# EAGLE design Pandora Driver-multi-page (EAGLE 5.11)
MFG: AVX; PN: TCJR106M006R0500

## Sheet 1 of 3
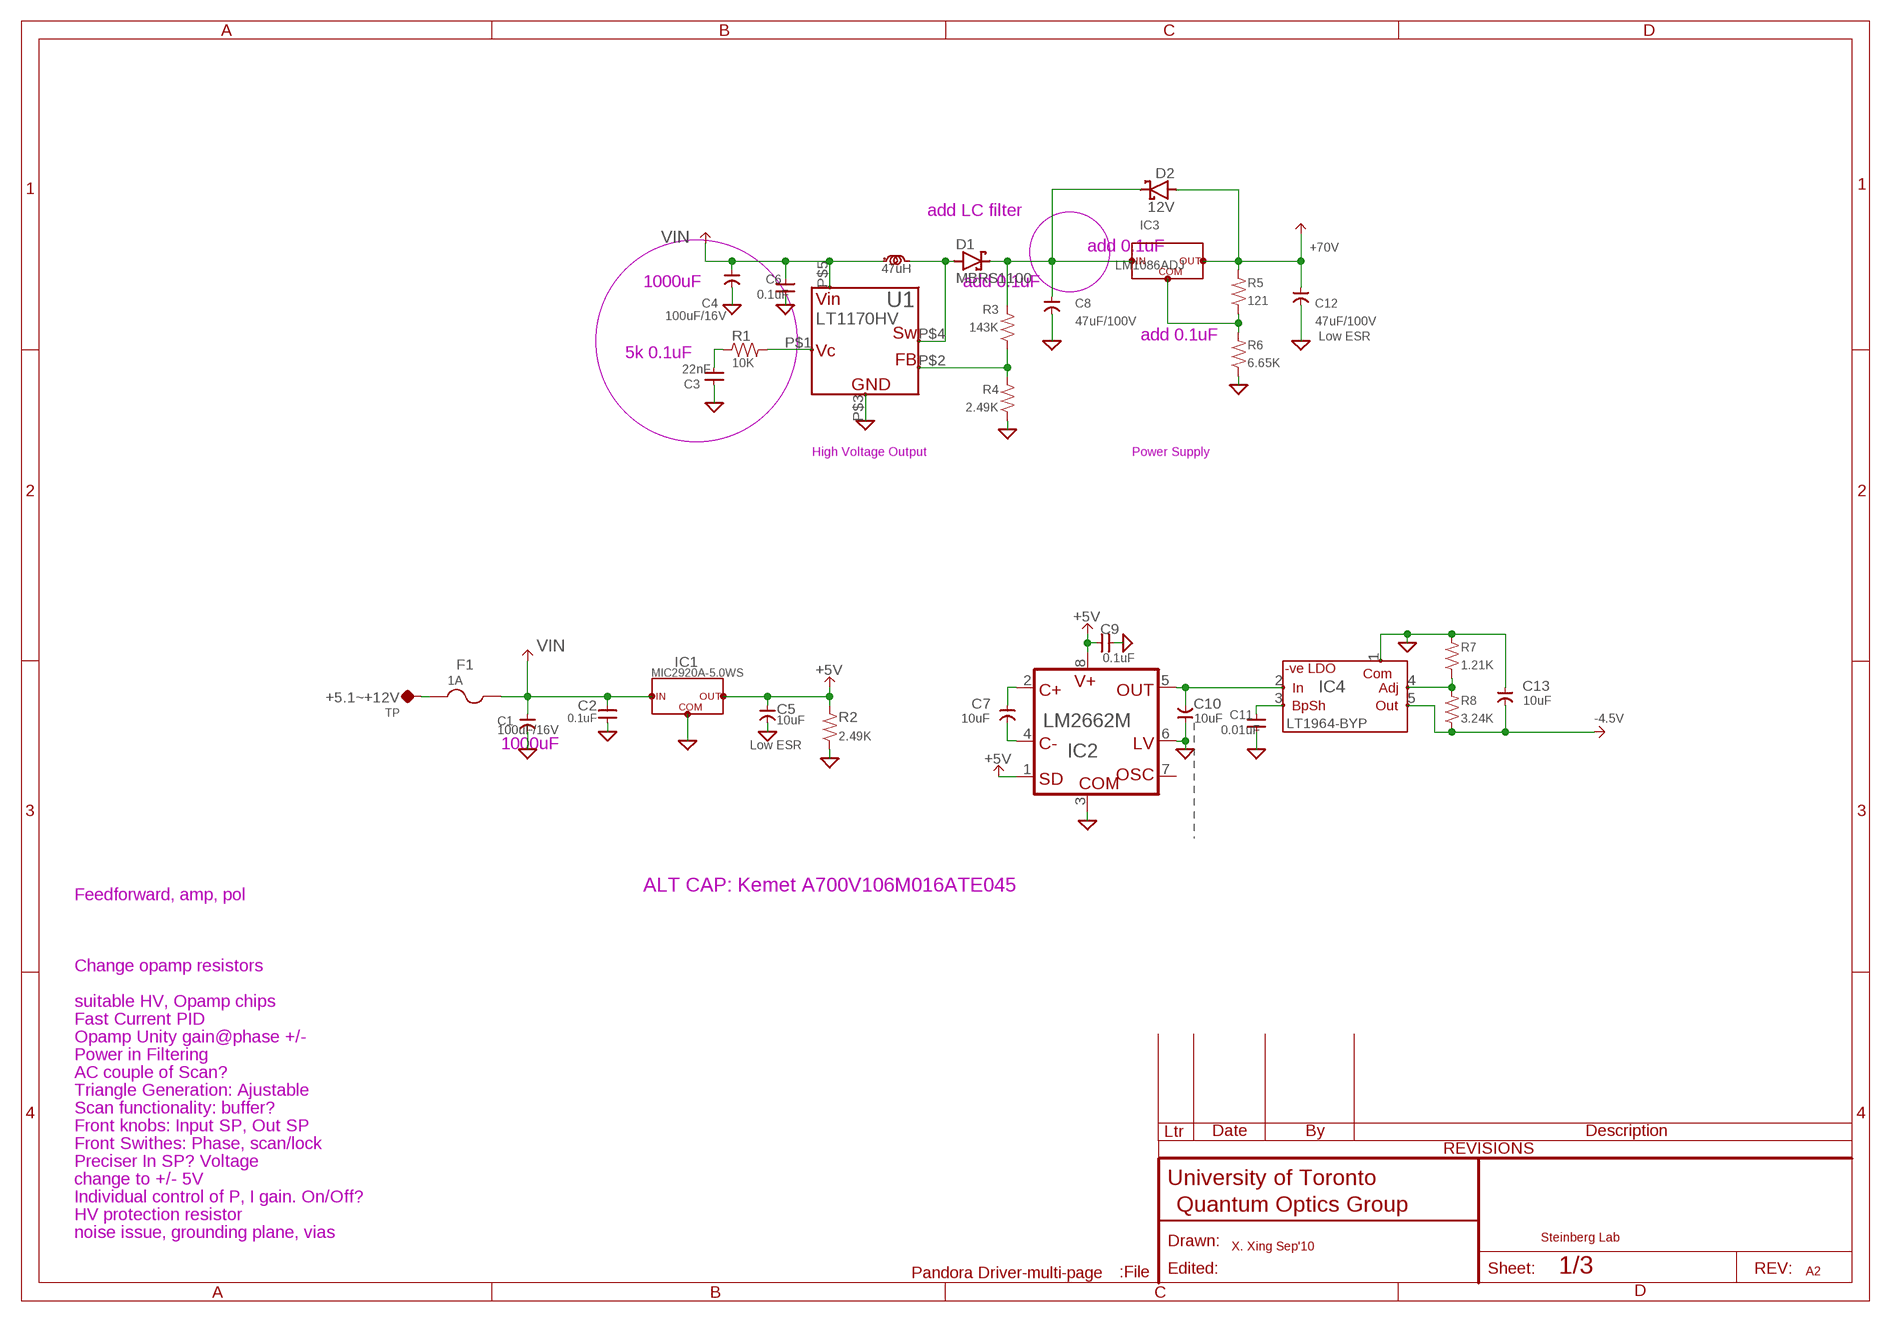
[diagram p0: schematic, sheet 1]

### Parts
+5.1~+12V  TP  TP-0.052"  [TP-0.052]
C1  100uF/16V  CAP-POL-PANA-D  [PANASONIC_D]
C2  0.1uF  CAP-V-0805  [2012(0805)]
C3  22nF  CAP-H-0805  [2012(0805)]
C4  100uF/16V  CAP-POL-PANA-D  [PANASONIC_D]
C5  10uF  CAP-POL--EIA7343  [7343]
C6  0.1uF  CAP-H-0805  [2012(0805)]
C7  10uF  CAP-POL--EIA7343  [7343]
C8  47uF/100V  CAP-POL-G13(X)  [PANASONIC_G13X]
C9  0.1uF  CAP-H-0805  [2012(0805)]
C10  10uF  CAP-POL--EIA7343  [7343]
C11  0.01uF  CAP-H-0805  [2012(0805)]
C12  47uF/100V  CAP-POL-G13(X)  [PANASONIC_G13X]
C13  10uF  CAP-POL--EIA7343  [7343]
D1  MBRS1100  MBRS130  [EIA-B(SMB)]
D2  12V  DIODE,SCHOTTKY-SOT-23  [SOT23]
F1  1A  FUSE-LITTLEFUSE_0154  [FUSE:LITTLEFUSE_0154]
IC1  MIC2920A-5.0WS  REGULATOR:3PIN-SOT223(TAB,2PINS)  [SOT223(C)]
IC2  LM2662M  LM2663M  [SOIC-8@1]
IC3  LM1086ADJ  REGULATOR:LM1086(LDO)-TO263  [TO263]
IC4  LT1964-BYP  REGULATOR:LT1964(NEG,200MA)-ES5-  [SOT23-5]
L1  47uH  INDUCTOR-PANASONIC_ELLATV  [PANASONIC_ELLATV(COIL)]
R1  10K  R-H-0805  [2012(0805)]
R2  2.49K  R-V-0805  [2012(0805)]
R3  143K  R-H-0805  [2012(0805)]
R4  2.49K  R-H-0805  [2012(0805)]
R5  121  R-H-0805  [2012(0805)]
R6  6.65K  R-H-0805  [2012(0805)]
R7  1.21K  R-H-0805  [2012(0805)]
R8  3.24K  R-H-0805  [2012(0805)]
U1  LT1170HV  [TO263-5]

### Nets
+5V [power]: C5.+VE(POS) C9.1 IC1.3(OUT) IC2.1(SD) IC2.8(V+) R2.2 ; also sheet 2,3
+70V [power]: C12.+(POS) D2.1(A) IC3.2(OUT) R5.2 ; also sheet 3
-4.5V [power]: C13.-VE(NEG) IC4.5(OUT) R8.1 ; also sheet 2,3
-5IN [power]: C10.-VE(NEG) IC2.5(OUT) IC4.2(IN)
GND: C1.-(NEG) C2.1 C3.2 C4.-(NEG) C5.-VE(NEG) C6.1 C8.-(NEG) C9.2 C10.+VE(POS) C11.1 C12.-(NEG) C13.+VE(POS) IC1.2(COM) IC2.3(COM) IC2.6(LV) IC4.1(COM) R2.1 R4.1 R6.1 R7.2 U1.P$3(GND) ; also sheet 2,3
N$010 [power]: +5.1~+12V.TP F1.1(1A)
N$13: R1.2 U1.P$1(VC)
N$17: C3.1 R1.1
N$19: R3.1 R4.2 U1.P$2(FB)
N$22 [power]: D1.A-(A) L1.2(B) U1.P$4(SW)
N$033 [power]: C8.+(POS) D1.K+(C) D2.3(C) IC3.3(VI) R3.2
N$034: IC3.1(COM) R5.1 R6.2
N$041: C7.+VE(POS) IC2.2(C+)
N$042: C7.-VE(NEG) IC2.4(C-)
N$057: C11.2 IC4.3(BP/SH)
N$060: IC4.4(ADJ) R7.1 R8.2
VIN [power]: C1.+(POS) C2.2 C4.+(POS) C6.2 F1.2(2A) IC1.1(VI) L1.1(A) U1.P$5(VIN)
Unconnected: IC2.7(OSC)

### Notes on the sheet
- add LC filter
- add 0.1uF
- 1000uF | add 0.1uF
- add 0.1uF | Low ESR
- 5k 0.1uF
- High Voltage Output | Power Supply
- 1000uF | Low ESR
- ALT CAP: Kemet A700V106M016ATE045
- Feedforward, amp, pol
- Change opamp resistors
- suitable HV, Opamp chips
- Fast Current PID
- Opamp Unity gain@phase +/-
- Power in Filtering
- AC couple of Scan?
- Triangle Generation: Ajustable
- Scan functionality: buffer?
- Front knobs: Input SP, Out SP
- Front Swithes: Phase, scan/lock
- Preciser In SP? Voltage
- change to +/- 5V
- Individual control of P, I gain. On/Off?
- HV protection resistor
- noise issue, grounding plane, vias
- Steinberg Lab
- X. Xing Sep'10
- A2

## Sheet 2 of 3
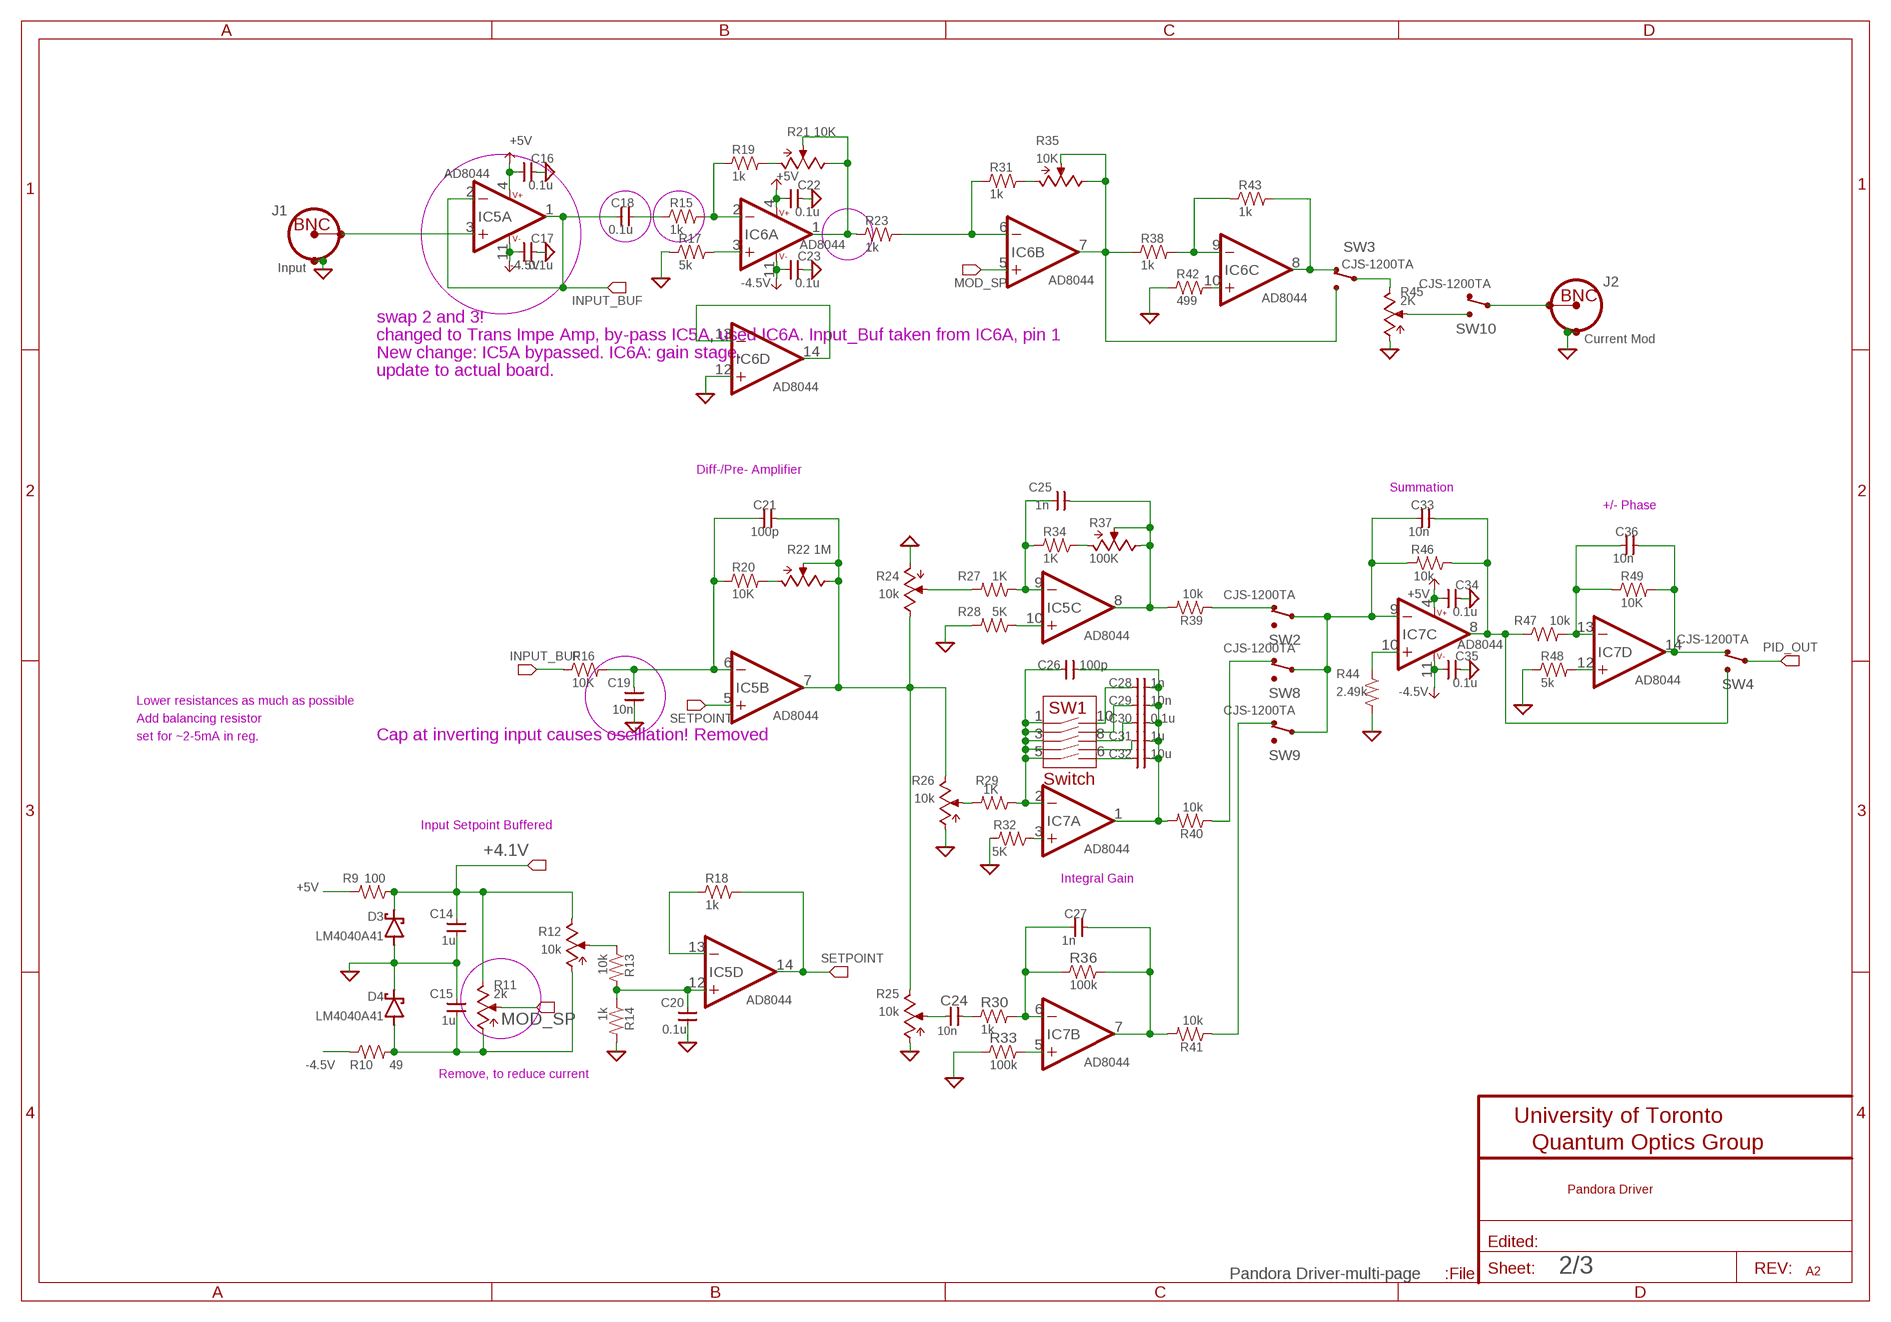
[diagram p1: schematic, sheet 2]

### Parts
C14  1u  CAP-H-0805  [2012(0805)]
C15  1u  CAP-H-0805  [2012(0805)]
C16  0.1u  CAP-H-0805  [2012(0805)]
C17  0.1u  CAP-H-0805  [2012(0805)]
C18  0.1u  CAP-H-0805  [2012(0805)]
C19  10n  CAP-H-0805  [2012(0805)]
C20  0.1u  CAP-H-0805  [2012(0805)]
C21  100p  CAP-H-0805  [2012(0805)]
C22  0.1u  CAP-H-0805  [2012(0805)]
C23  0.1u  CAP-H-0805  [2012(0805)]
C24  10n  CAP-H-0805  [2012(0805)]
C25  1n  CAP-H-0805  [2012(0805)]
C26  100p  CAP-H-0805  [2012(0805)]
C27  1n  CAP-H-0805  [2012(0805)]
C28  1n  CAP-H-0805  [2012(0805)]
C29  10n  CAP-H-0805  [2012(0805)]
C30  0.1u  CAP-H-0805  [2012(0805)]
C31  1u  CAP-H-0805  [2012(0805)]
C32  10u  CAP-H-0805  [2012(0805)]
C33  10n  CAP-H-0805  [2012(0805)]
C34  0.1u  CAP-H-0805  [2012(0805)]
C35  0.1u  CAP-H-0805  [2012(0805)]
C36  10n  CAP-H-0805  [2012(0805)]
D3  LM4040A41  DIODE,SCHOTTKY-SOT-23  [SOT23]
D4  LM4040A41  DIODE,SCHOTTKY-SOT-23  [SOT23]
IC5  AD8044  OPAMP:LT1491(RRIO+,QUAD)-SO14  [SOIC-14]
IC6  AD8044  OPAMP:LT1491(RRIO+,QUAD)-SO14  [SOIC-14]
IC7  AD8044  OPAMP:LT1491(RRIO+,QUAD)-SO14  [SOIC-14]
J1  Input  CONN-BNC-TYPE1VERT  [CONN-BNC-AMP-TYPE1VERT]
J2  Current Mod  CONN-BNC-TYPE1VERT  [CONN-BNC-AMP-TYPE1VERT]
R9  100  R-H-0805  [2012(0805)]
R10  49  R-H-0805  [2012(0805)]
R11  2k  POT-3214W_TRIM  [BOURNS_3214]
R12  10k  POT-3214W_TRIM  [BOURNS_3214]
R13  10k  R-H-0805  [2012(0805)]
R14  1k  R-H-0805  [2012(0805)]
R15  1k  R-H-0805  [2012(0805)]
R16  10K  R-H-0805  [2012(0805)]
R17  5k  R-H-0805  [2012(0805)]
R18  1k  R-H-0805  [2012(0805)]
R19  1k  R-H-0805  [2012(0805)]
R20  10K  R-H-0805  [2012(0805)]
R21  10K  POT-3214W_TRIM  [BOURNS_3214]
R22  1M  POT-3214W_TRIM  [BOURNS_3214]
R23  1k  R-H-0805  [2012(0805)]
R24  10k  POT-3214W_TRIM  [BOURNS_3214]
R25  10k  POT-3214W_TRIM  [BOURNS_3214]
R26  10k  POT-3214W_TRIM  [BOURNS_3214]
R27  1K  R-H-0805  [2012(0805)]
R28  5K  R-H-0805  [2012(0805)]
R29  1K  R-H-0805  [2012(0805)]
R30  1k  R-H-0805  [2012(0805)]
R31  1k  R-H-0805  [2012(0805)]
R32  5K  R-H-0805  [2012(0805)]
R33  100k  R-H-0805  [2012(0805)]
R34  1K  R-H-0805  [2012(0805)]
R35  10K  POT-3214W_TRIM  [BOURNS_3214]
R36  100k  R-H-0805  [2012(0805)]
R37  100K  POT-3214W_TRIM  [BOURNS_3214]
R38  1k  R-H-0805  [2012(0805)]
R39  10k  R-H-0805  [2012(0805)]
R40  10k  R-H-0805  [2012(0805)]
R41  10k  R-H-0805  [2012(0805)]
R42  499  R-H-0805  [2012(0805)]
R43  1k  R-H-0805  [2012(0805)]
R44  2.49k  R-H-0805  [2012(0805)]
R45  2K  POT-3214W_TRIM  [BOURNS_3214]
R46  10k  R-H-0805  [2012(0805)]
R47  10k  R-H-0805  [2012(0805)]
R48  5k  R-H-0805  [2012(0805)]
R49  10K  R-H-0805  [2012(0805)]
SW1  Switch  SWITCH:5PDT  [SWITCH:CTS219-5MST]
SW2  CJS-1200TA  SWITCH:SPDT_CJS-1200A1  [SWITCH:DIP(COPAL)]
SW3  CJS-1200TA  SWITCH:SPDT_CJS-1200A1  [SWITCH:DIP(COPAL)]
SW4  CJS-1200TA  SWITCH:SPDT_CJS-1200A1  [SWITCH:DIP(COPAL)]
SW8  CJS-1200TA  SWITCH:SPDT_CJS-1200A1  [SWITCH:DIP(COPAL)]
SW9  CJS-1200TA  SWITCH:SPDT_CJS-1200A1  [SWITCH:DIP(COPAL)]
SW10  CJS-1200TA  SWITCH:SPDT_CJS-1200A1  [SWITCH:DIP(COPAL)]

### Nets
+4.1V: C14.2 D3.3(C) R9.1 R11.CW R12.CW ; also sheet 3
+5V [power]: C16.1 C22.1 C34.1 IC5.4(V++) IC6.4(V++) IC7.4(V++) R9.2 ; also sheet 1,3
-4.5V [power]: C17.1 C23.1 C35.1 IC5.11(V-) IC6.11(V-) IC7.11(V-) R10.1 ; also sheet 1,3
CUR_MOD2: J2.CONDUCTOR SW10.COM
CUR_MOD_P3: IC6.7(B:OUT) R35.CW R35.W R38.1 SW3.1(NO\UP\RIGHT)
CUR_MOD_P4: IC6.8(C:OUT) R43.2 SW3.2(NC\DOWN\LEFT)
GND: C14.1 C15.2 C16.2 C17.2 C19.1 C20.1 C22.2 C23.2 C34.2 C35.2 D3.1(A) D4.3(C) IC6.12(D:+IN) J1.SHIELD1 J1.SHIELD2 J2.SHIELD1 J2.SHIELD2 R14.2 R17.1 R24.CCW R25.CCW R26.CCW R28.2 R32.2 R33.1 R42.1 R44.2 R45.CCW R48.1 ; also sheet 1,3
INPUT_BUF: C18.2 IC5.1(A:OUT) IC5.2(A:-IN) R16.1
MOD_SP: IC6.5(B:+IN) R11.W
N$004: C19.2 C21.1 IC5.6(B:-IN) R16.2 R20.1
N$006: C31.1 SW1.7(4B)
N$009: C21.2 IC5.7(B:OUT) R22.CW R22.W R24.CW R25.CW R26.CW
N$011: IC6.3(A:+IN) R17.2
N$012: R24.W R27.2
N$014: C25.1 IC5.9(C:-IN) R27.1 R34.2
N$015: C25.2 IC5.8(C:OUT) R37.CW R37.W R39.2
N$016: C29.1 SW1.9(2B)
N$018: C30.1 SW1.8(3B)
N$020: C32.1 SW1.6(5B)
N$021: C26.2 C28.2 C29.2 C30.2 C31.2 C32.2 IC7.1(A:OUT) R40.2
N$023: R26.W R29.2
N$024: C20.2 IC5.12(D:+IN) R13.2 R14.1
N$025: R12.W R13.1
N$026: C26.1 IC7.2(A:-IN) R29.1 SW1.1(1A) SW1.2(2A) SW1.3(3A) SW1.4(4A) SW1.5(5A)
N$027: C28.1 SW1.10(1B)
N$028: R45.W SW10.1(NO\UP\RIGHT)
N$029: C33.2 IC7.8(C:OUT) R46.1 R47.1 SW4.1(NO\UP\RIGHT)
N$030: IC7.5(B:+IN) R33.2
N$031: IC5.13(D:-IN) R18.1
N$032: IC5.10(C:+IN) R28.1
N$035: IC7.10(C:+IN) R44.1
N$037: IC7.12(D:+IN) R48.2
N$038: C36.2 IC7.14(D:OUT) R49.2 SW4.2(NC\DOWN\LEFT)
N$039: R20.2 R22.CCW
N$040: C24.1 R25.W
N$050: C27.1 IC7.6(B:-IN) R30.2 R36.1
N$051: C27.2 IC7.7(B:OUT) R36.2 R41.2
N$052: C24.2 R30.1
N$053: C36.1 IC7.13(D:-IN) R47.2 R49.1
N$054: IC6.10(C:+IN) R42.2
N$056: IC7.3(A:+IN) R32.1
N$061: C33.1 IC7.9(C:-IN) R46.2 SW2.COM SW8.COM SW9.COM
N$062: IC6.13(D:-IN) IC6.14(D:OUT)
N$065: IC5.3(A:+IN) J1.CONDUCTOR
N$085: R34.1 R37.CCW
N$093: C15.1 D4.1(A) R10.2 R11.CCW R12.CCW
N$097: C18.1 R15.1
N$098: IC6.2(A:-IN) R15.2 R19.1
N$099: IC6.1(A:OUT) R21.CW R21.W R23.1
N$100: IC6.6(B:-IN) R23.2 R31.1
N$101: IC6.9(C:-IN) R38.2 R43.1
N$102: R40.1 SW8.2(NC\DOWN\LEFT)
N$103: R41.1 SW9.2(NC\DOWN\LEFT)
N$104: R39.1 SW2.2(NC\DOWN\LEFT)
N$105: R19.2 R21.CCW
N$106: R31.2 R35.CCW
N$107: R45.CW SW3.COM
PID_OUT: SW4.COM ; also sheet 3
SETPOINT: IC5.5(B:+IN) IC5.14(D:OUT) R18.2 ; also sheet 3
Unconnected: SW2.1(NO\UP\RIGHT) SW8.1(NO\UP\RIGHT) SW9.1(NO\UP\RIGHT) SW10.2(NC\DOWN\LEFT)

### Notes on the sheet
- swap 2 and 3!
- changed to Trans Impe Amp, by-pass IC5A, used IC6A. Input_Buf taken from IC6A, pin 1
- New change: IC5A bypassed. IC6A: gain stage.
- update to actual board.
- Diff-/Pre- Amplifier
- Summation
- +/- Phase
- Lower resistances as much as possible
- Add balancing resistor
- set for ~2-5mA in reg. | Cap at inverting input causes oscillation! Removed
- Input Setpoint Buffered
- Integral Gain
- Remove, to reduce current
- Pandora Driver
- A2

## Sheet 3 of 3
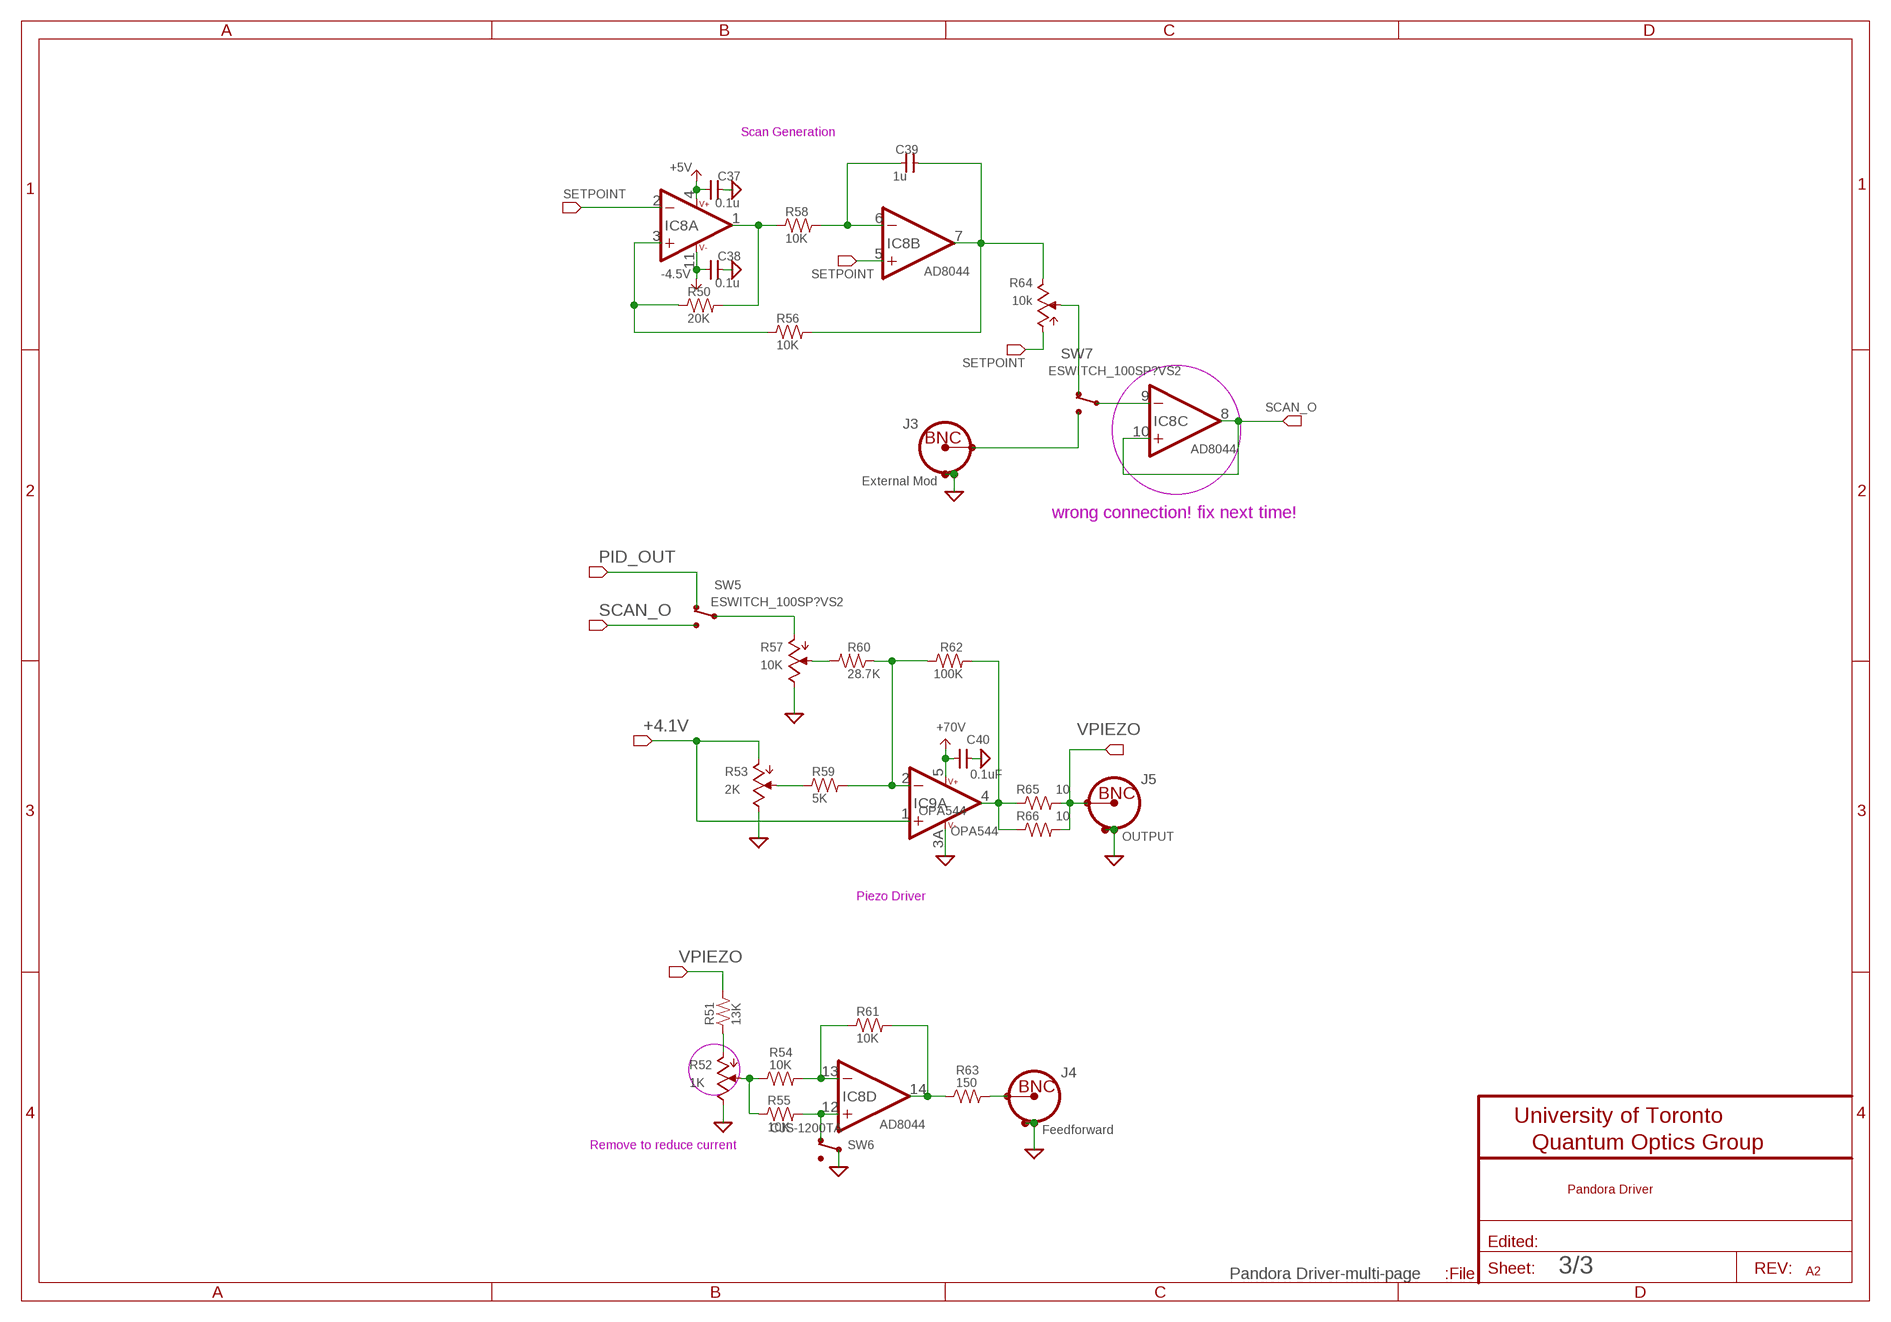
[diagram p2: schematic, sheet 3]

### Parts
C37  0.1u  CAP-H-0805  [2012(0805)]
C38  0.1u  CAP-H-0805  [2012(0805)]
C39  1u  CAP-H-0805  [2012(0805)]
C40  0.1uF  CAP-H-0805  [2012(0805)]
IC8  AD8044  OPAMP:LT1491(RRIO+,QUAD)-SO14  [SOIC-14]
IC9  OPA544  OPAMP:OPA544-TO263(KTT)  [TO263-5(KTT)]
J3  External Mod  CONN-BNC-TYPE1VERT  [CONN-BNC-AMP-TYPE1VERT]
J4  Feedforward  CONN-BNC-TYPE1VERT  [CONN-BNC-AMP-TYPE1VERT]
J5  OUTPUT  CONN-BNC-TYPE1VERT  [CONN-BNC-AMP-TYPE1VERT]
R50  20K  R-H-0805  [2012(0805)]
R51  13K  R-H-0805  [2012(0805)]
R52  1K  POT-3214W_TRIM  [BOURNS_3214]
R53  2K  POT-3590  [BOURNS_3590]
R54  10K  R-H-0805  [2012(0805)]
R55  10K  R-H-0805  [2012(0805)]
R56  10K  R-H-0805  [2012(0805)]
R57  10K  POT-3214W_TRIM  [BOURNS_3214]
R58  10K  R-H-0805  [2012(0805)]
R59  5K  R-H-0805  [2012(0805)]
R60  28.7K  R-H-0805  [2012(0805)]
R61  10K  R-H-0805  [2012(0805)]
R62  100K  R-H-0805  [2012(0805)]
R63  150  R-H-0805  [2012(0805)]
R64  10k  POT-3214W_TRIM  [BOURNS_3214]
R65  10  R-H-0805  [2012(0805)]
R66  10  R-H-0805  [2012(0805)]
SW5  ESWITCH_100SP?VS2  SWITCH:SPDT-ESWITCH_100SP?VS2  [SWITCH-ESWITCH_100SP?VS2]
SW6  CJS-1200TA  SWITCH:SPDT_CJS-1200A1  [SWITCH:DIP(COPAL)]
SW7  ESWITCH_100SP?VS2  SWITCH:SPDT-ESWITCH_100SP?VS2  [SWITCH-ESWITCH_100SP?VS2]

### Nets
+4.1V: IC9.1(A:+IN) R53.CCW ; also sheet 2
+5V [power]: C37.1 IC8.4(V++) ; also sheet 1,2
+70V [power]: C40.1 IC9.5(B:V++) ; also sheet 1
-4.5V [power]: C38.1 IC8.11(V-) ; also sheet 1,2
GND: C37.2 C38.2 C40.2 IC9.3A(B:V-) J3.SHIELD1 J3.SHIELD2 J4.SHIELD1 J4.SHIELD2 J5.SHIELD1 J5.SHIELD2 R52.CW R53.CW R57.CW SW6.COM ; also sheet 1,2
N$001: R51.1 R52.CCW
N$002: R52.W R54.1 R55.1
N$003: IC8.13(D:-IN) R54.2 R61.1
N$005: IC8.14(D:OUT) R61.2 R63.1
N$007: IC8.12(D:+IN) R55.2 SW6.2(NC\DOWN\LEFT)
N$008: J4.CONDUCTOR R63.2
N$036: IC8.3(A:+IN) R50.1 R56.1
N$043: C39.2 IC8.7(B:OUT) R56.2 R64.CW
N$044: IC8.1(A:OUT) R50.2 R58.1
N$045: C39.1 IC8.6(B:-IN) R58.2
N$046: IC9.2(A:-IN) R59.2 R60.1 R62.1
N$047: IC9.4(A:OUT) R62.2 R65.1 R66.1
N$048: R53.W R59.1
N$049: R57.W R60.2
N$055: R64.W SW7.NC(NC\DOWN\LEFT)
N$058: IC8.9(C:-IN) SW7.C(COM)
N$059: J3.CONDUCTOR SW7.NO(NO\UP\RIGHT)
PID_OUT: SW5.NC(NC\DOWN\LEFT) ; also sheet 2
PIEZO_CTRL1: R57.CCW SW5.C(COM)
SCAN_O: IC8.8(C:OUT) IC8.10(C:+IN) SW5.NO(NO\UP\RIGHT)
SETPOINT: IC8.2(A:-IN) IC8.5(B:+IN) R64.CCW ; also sheet 2
VPIEZO: J5.CONDUCTOR R51.2 R65.2 R66.2
Unconnected: SW6.1(NO\UP\RIGHT)

### Notes on the sheet
- Scan Generation
- wrong connection! fix next time!
- Piezo Driver
- Remove to reduce current
- Pandora Driver
- A2

## Library data of the parts
+5.1~+12V = QuantumOptics:TP: Testpoint, either SMT pad, small hole or loop style TP such as Keystone 5002K (0.042").
C1 C4 C8 C12 = QuantumOptics-x:CAP-POL-: Capacitor, Polarized, SMT 0805 and up, probably tantalum.
C2 = QuantumOptics:CAP-V-: Cap, SMT and Through-hole, 0402 and up.
C3 C6 C9 C11 C14-C40 = QuantumOptics:CAP-H-: Cap, SMT and Through-hole, 0402 and up.
C5 C7 C10 C13 = QuantumOptics:CAP-POL-: Capacitor, Polarized, SMT 0805 and up, probably tantalum.
D1 = QuantumOptics:MBRS130: MBRS130LT3, ON Semi et al, schottky, 1A 30V, SMB. General purpose schottky in SMT.
D2-D4 = QuantumOptics:DIODE,SCHOTTKY: Schottky Diode, general purpose.
F1 = QuantumOptics:FUSE: Fuse
IC1 = QuantumOptics-x:REGULATOR:3PIN: LM1086-xxx, National Semiconductor, LDO, adjustable or fixed. http://cache.national.com/ds/LM/LM1086.pdf
IC2 = QuantumOptics:LM2663: LM2663, switched cap DC-DC converter. Inverter, doubler, supply splitter.
IC3 = QuantumOptics:REGULATOR:LM1086(LDO): LM1086-xxx, National Semiconductor, LDO, adjustable or fixed. http://cache.national.com/ds/LM/LM1086.pdf
IC4 = QuantumOptics:REGULATOR:LT1964(NEG,200MA): LT1964, LinTech, negative LDO, 200mA, fixed or -5V, very low noise. Three versions: 1) adj with shutdown, 2) adj with reference bypass, 3) fixed 5V with bypass and shutdown. http://www.linear.com/pc/downloadDocument.do?navId=H0,C1,C1003,C1040,C1019,P2168,D1258
IC5-IC8 = QuantumOptics:OPAMP:LT1491(RRIO+,QUAD): LT1491, Linear Technology quad op-amp. Low power, RRIO plus "over the top" inputs, high gain, low Vio, low Ib, low GBW too.
IC9 = QuantumOptics:OPAMP:OPA544: Op Amp, generic, pick the right package. e.g. AD8605: SOT-23-5, RRIO, 10MHz, Ib = 1pA, Vio < 65uV, 2.7-5.5V.
J1-J5 = QuantumOptics:CONN-BNC: BNC PCB, horizontal or vertical, e.g. Horiz: Amp (5)227677-1, nut 1-329631-2, shoulder washer 330620, vert isolated 5227222-6, http://catalog.tycoelectronics.com/TE/bin/TE.Connect?C=1&M=BYPN&TCPN=5227222-6&RQPN=5227222-6 http://catalog.tycoelectronics.com/TE/bin/TE.Connect?C=1&PN=227677-1&M=STARTSWITH&LG=1&I=13&button.x=0&button.y=0 http://catalog.tycoelectronics.com/TE/bin/TE.Connect?C=1&M=BYPN&PID=4946&PN=227673-1&I=13; DESC: Input?
L1 = QuantumOptics-x:INDUCTOR: Inductor, generic inductor.
R1 R3-R10 R13-R20 R23 R27-R34 R36 R38-R44 R46-R51 R54-R56 R58-R63 R65 R66 = QuantumOptics:R-H-*: Resistor, SMT & Through-Hole, horizontal symbol
R2 = QuantumOptics:R-V-*: Resistor, SMT & Through-Hole, vertical symbol
R11 R12 R21 R22 R24-R26 R35 R37 R45 R53 = QuantumOptics:POT: Pot, regular or trimpot
R52 R57 R64 = QuantumOptics-x:POT: Pot, regular or trimpot
SW1 = QuantumOptics-x:SWITCH:5PDT: 5 position DIP switch, through-hole.
SW2-SW10 = QuantumOptics:SWITCH:SPDT: Switch, SPDT
U1 = QuantumOptics:LT1170HV

## Net classes
0 default: width 0.178 mm, drill 0.508 mm, clearance 0.178 mm
1 power: width 0.508 mm, drill 0.711 mm

## Board
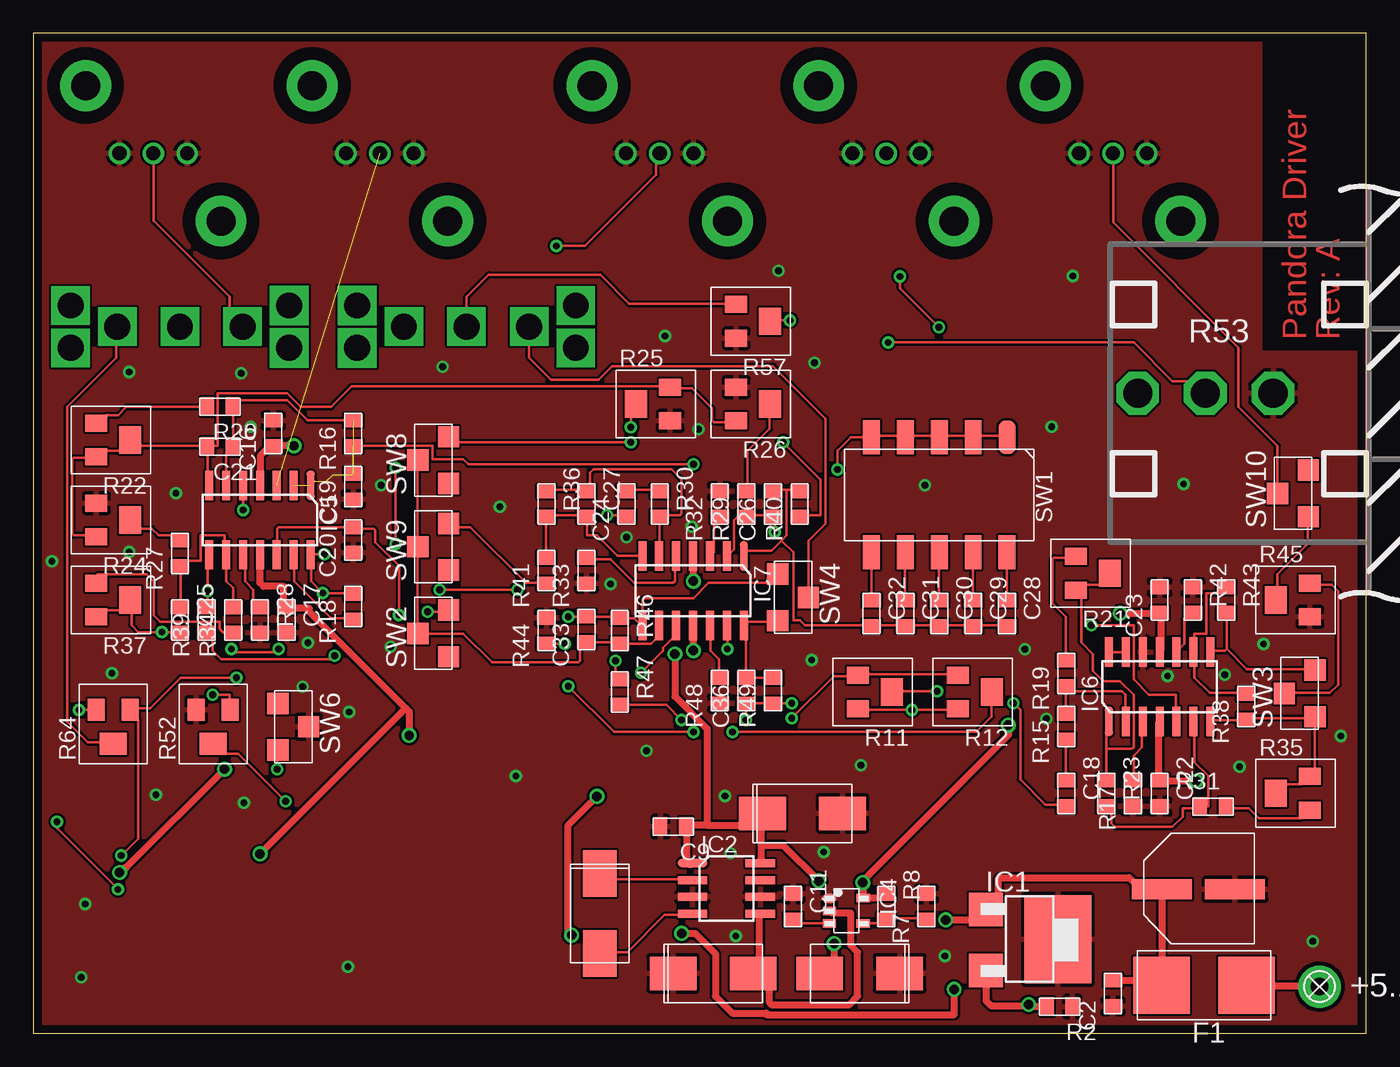
[diagram p3: board, top side]
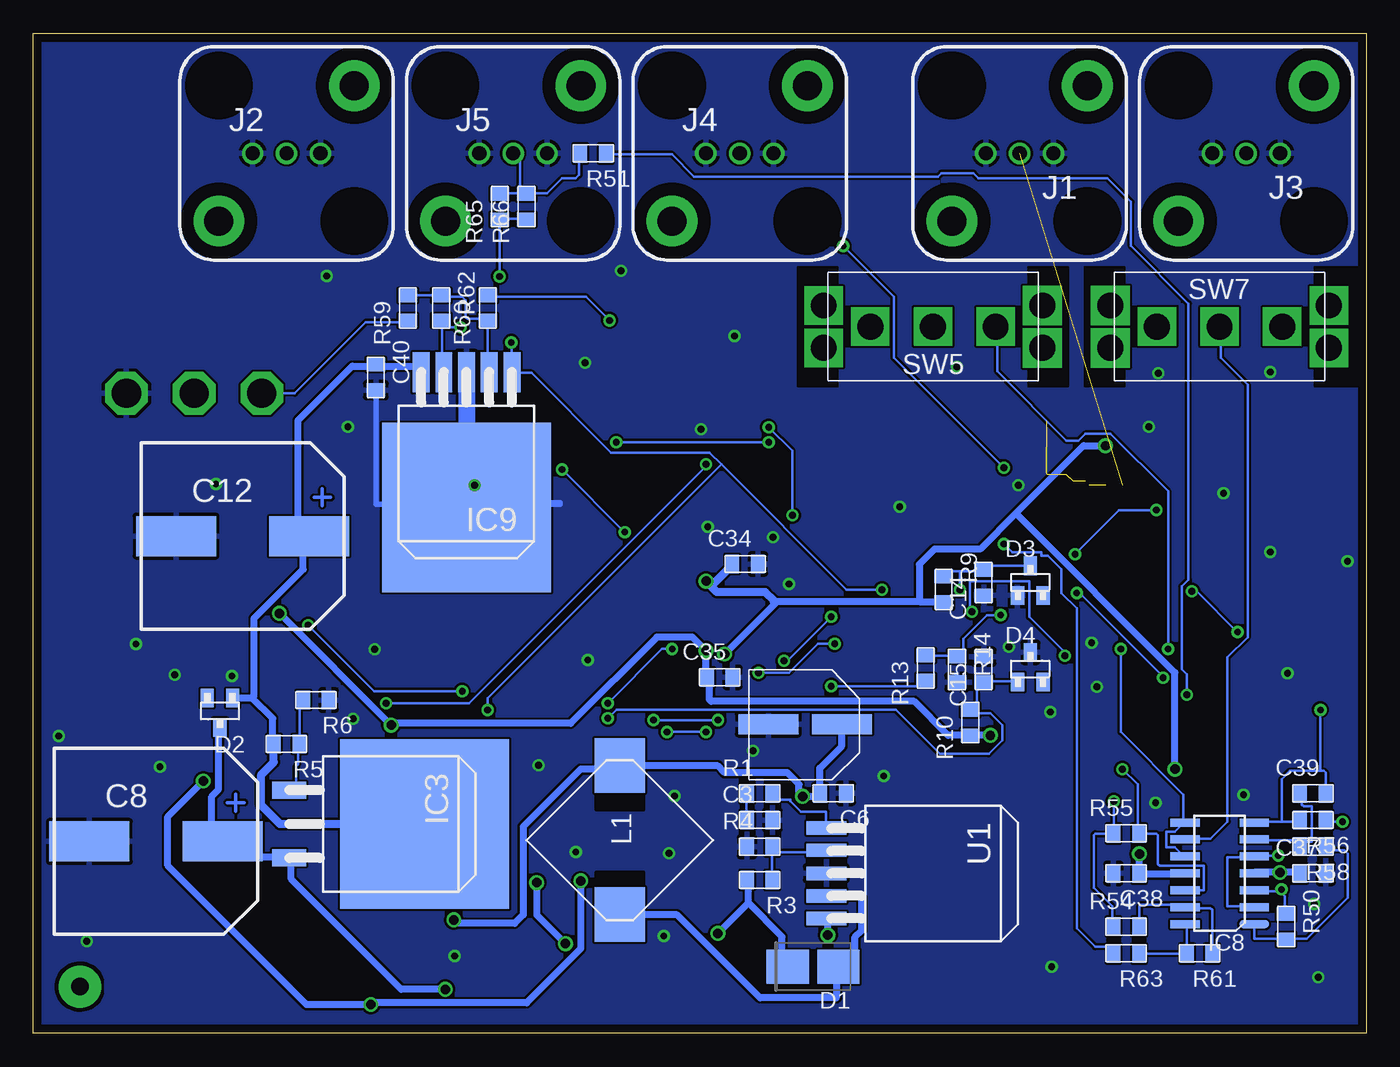
[diagram p4: board, bottom side, seen from below]

Size 100 x 75 mm. Coordinates in mm from the lower left corner, seen from the top.
Outline: 0,0 100,0 100,75 0,75 0,0
Copper layers (1+16): Top 0.035mm / dielectric 1.5mm / Bottom 0.035mm
Design rules "DRC standard check": minimum track width 7mil, minimum drill 20mil, track to track 7mil, track to pad 7mil, pad to pad 7mil, via to via 7mil, smd to smd 0mil, copper to edge 25mil, drill to drill 8mil, minimum pad ring 10mil, minimum via ring 8mil, stop-mask expansion 4mil, vias tented up to drill 0mil, thermal gap 10mil
bKeepout: area 25,6 to 34,18

### Footprints (pad centres in the part's own frame; a part is rotated, then mirrored left to right if it is on the bottom)
TP-0.052 = drill 1.321 pad 3.175 round: TP 0,0
PANASONIC_D = smd 4.5 x 1.5: + 2.75,0; - -2.75,0
2012(0805) = smd 1.016 x 1.397: 1 -0.953,0; 2 0.953,0
7343 = smd 3.5 x 2.5: +VE -3,0; -VE 3,0
PANASONIC_G13X = smd 3 x 6: + 0,-5; - 0,5
EIA-B(SMB) = smd 3.175 x 2.54: A- -1.905,0; K+ 1.905,0
SOT23 = smd 1 x 1.4: 1 -0.953,-0.953; 2 0.953,-0.953; 3 0,1.27
FUSE:LITTLEFUSE_0154 = smd 4.25 x 4.25: 1 -3.185,0; 2 3.185,0
SOT223(C) = smd 2.54 x 2.54: 1 -2.286,-2.54; 3 2.286,-2.54 | smd 6.6 x 5: 2 -0.05,2.87
SOIC-8@1 = smd 0.6 x 2.2: 1 -1.27,-2.54; 2 0,-2.54; 3 1.27,-2.54; 4 2.54,-2.54; 5 2.54,2.54; 6 1.27,2.54; 7 0,2.54; 8 -1.27,2.54
TO263 = smd 1.27 x 2.54: 1 -2.54,0; 3 2.54,0 | smd 12.7 x 12.7: 2 0,10.16
SOT23-5 = smd 0.635 x 0.991: 1 -0.635,-1.27; 2 0.318,-1.27; 3 1.27,-1.27; 4 1.27,1.27; 5 -0.635,1.27
SOIC-14 = smd 0.6 x 2.2: 1 -3.81,-2.6; 2 -2.54,-2.6; 3 -1.27,-2.6; 4 0,-2.6; 5 1.27,-2.6; 6 2.54,-2.6; 7 3.81,-2.6; 8 3.81,2.6; 9 2.54,2.6; 10 1.27,2.6; 11 0,2.6; 12 -1.27,2.6; 13 -2.54,2.6; 14 -3.81,2.6
TO263-5(KTT) = smd 1.27 x 3: 1 -3.404,0; 2 -1.702,0; 3A 0,0; 4 1.702,0; 5 3.404,0 | smd 12.7 x 12.7: 3B 0,10.16
CONN-BNC-AMP-TYPE1VERT = drill 1.067 round: CONDUCTOR 0,0; SHIELD1 -2.54,0; SHIELD2 2.54,0 | drill 2.184 pad 3.81 round: MTG1 -5.08,-5.08; MTG2 5.08,5.08
PANASONIC_ELLATV(COIL) = smd 4.064 x 3.81: 1 -5.588,0; 2 5.588,0
BOURNS_3214 = smd 1.651 x 1.27: CCW 1.27,-1.27; CW 1.27,1.27 | smd 1.651 x 2.032: W -1.27,0
BOURNS_3590 = drill 2.184 octagon: CCW -12.065,0; CW -6.985,0; W -17.145,0
SWITCH:CTS219-5MST = smd 1.27 x 2.54: 1 -5.08,-4.318; 2 -2.54,-4.318; 3 0,-4.318; 4 2.54,-4.318; 5 5.08,-4.318; 6 5.08,4.318; 7 2.54,4.318; 8 0,4.318; 9 -2.54,4.318; 10 -5.08,4.318
SWITCH:DIP(COPAL) = smd 1.6 x 1.6: 1 -1.75,-1.15; 2 1.75,-1.15; COM 0,1.15
SWITCH-ESWITCH_100SP?VS2 = drill 1.93 square: C 0,0; MTG3 8.2,1.59; MTG4 8.2,-1.59; NC 4.7,0; NO -4.7,0 | drill 1.93 pad 2.946 square: MTG1 -8.2,-1.59; MTG2 -8.2,1.59
TO263-5 = smd 1 x 3: P$1 -3.404,-8.001; P$2 -1.727,-8.001; P$3 0,-8.001; P$4 1.702,-8.001; P$5 3.378,-7.976

### Placement (x,y rotation side)
+5.1~+12V  96.5,3.5 0 top
C1  87.4,10.8 180 top
C2  81,3 90 top
C3  45.5,16 0 bottom
C4  42.1,23.2 0 bottom
C5  57.7,16.5 0 top
C6  40,18 180 bottom
C7  42.5,9 270 top
C8  90.8,14.4 90 bottom
C9  48,15.5 180 top
C10  51,4.5 0 top
C11  57,9.5 270 top
C12  84.3,37.3 90 bottom
C13  62,4.5 180 top
C14  28.7,33.8 90 bottom
C15  28.7,27.3 90 bottom
C16  18,45 90 top
C17  19,31 270 top
C18  77.5,18 270 top
C19  24,41 90 top
C20  24,37 90 top
C21  14,44 180 top
C22  84.5,18 270 top
C23  84.5,32.5 90 top
C24  44.5,39.7 90 top
C25  11,31 270 top
C26  55.5,39.7 90 top
C27  41.5,39.7 270 top
C28  73.05,31.5 270 top
C29  70.51,31.5 270 top
C30  67.97,31.5 270 top
C31  65.43,31.5 270 top
C32  62.89,31.5 270 top
C33  41.5,30.3 90 top
C34  46.6,35.2 0 bottom
C35  48.5,26.7 0 bottom
C36  53.5,25.7 90 top
C37  4,12 0 bottom
C38  18,12 180 bottom
C39  4,18 0 bottom
C40  74.3,49.2 270 bottom
D1  41.5,5 180 bottom
D2  86,24.2 180 bottom
D3  25.2,33.8 0 bottom
D4  25.2,27.3 0 bottom
F1  87.83,3.61 180 top
IC1  74,7 270 top
IC2  52,11.5 270 top
IC3  80.8,15.7 270 bottom
IC4  61,9.5 270 top
IC5  17,38.5 180 top
IC6  84.5,26 0 top
IC7  49.5,33.2 180 top
IC8  11,12 90 bottom
IC9  67.5,49.6 180 bottom
J1  26,66 180 bottom
J2  81,66 0 bottom
J3  9,66 180 bottom
J4  47,66 0 bottom
J5  64,66 0 bottom
L1  56,14.5 270 bottom
R1  45.5,18 0 bottom
R2  77,2 180 top
R3  45.5,11.5 180 bottom
R4  45.5,14 0 bottom
R5  81,21.7 180 bottom
R6  78.8,25 180 bottom
R7  67,9.5 90 top
R8  64,9.5 270 top
R9  31.7,33.3 270 bottom
R10  29.7,23.3 90 bottom
R11  63.15,25.6 180 top
R12  70.65,25.6 180 top
R13  33.05,27.4 90 bottom
R14  30.7,27.3 270 bottom
R15  77.5,23 90 top
R16  24,45 90 top
R17  82.5,18 90 top
R18  24,32 90 top
R19  77.5,27 90 top
R20  14,47 180 top
R21  79.5,34.5 180 top
R22  6,44.5 180 top
R23  80.5,18 270 top
R24  6,38.5 180 top
R25  46.5,47.2 0 top
R26  54,47.2 180 top
R27  11,36 90 top
R28  17,31 270 top
R29  53.5,39.7 90 top
R30  47,39.7 270 top
R31  88.5,17 0 top
R32  51.5,39.7 90 top
R33  41.5,34.7 90 top
R34  15,31 90 top
R35  94.5,18 0 top
R36  38.5,39.7 270 top
R37  6,32.5 180 top
R38  91,24.5 90 top
R39  13,31 90 top
R40  57.5,39.7 90 top
R41  38.5,34.7 90 top
R42  87,32.5 270 top
R43  89.5,32.5 270 top
R44  38.5,30.2 90 top
R45  94.5,32.5 0 top
R46  44,30.2 270 top
R47  44,25.6 270 top
R48  51.5,25.7 90 top
R49  55.5,25.7 90 top
R50  6,8 270 bottom
R51  58,66 180 bottom
R52  13.5,23 90 top
R53  100,48 0 top
R54  18,8 0 bottom
R55  18,15 0 bottom
R56  4,16 180 bottom
R57  54,53.4 180 top
R58  4,14 180 bottom
R59  71.9,54.4 90 bottom
R60  65.9,54.4 90 bottom
R61  12.5,6 180 bottom
R62  69.4,54.4 270 bottom
R63  18,6 180 bottom
R64  6,23 90 top
R65  65,62 90 bottom
R66  63,62 90 bottom
SW1  67.97,40.39 180 top
SW2  30,30 90 top
SW3  95,25.5 90 top
SW4  57,32.7 270 top
SW5  32.5,53 180 bottom
SW6  19.5,23 270 top
SW7  11,53 0 bottom
SW8  30,43 90 top
SW9  30,36.5 90 top
SW10  94.5,40.5 90 top
U1  32.5,12 270 bottom

### Tracks (layer width: path | path; a pad name or v marks a point on that pad's centre or on a via)
+4.1V  (via drill 0.51)
  Top 0.178: R11.CW 61.98,24.26 v65.91,24.26 69.34,24.26 R12.CW | v64.14,51.82 82.55,51.82 85.47,48.9 87,48.9 87.88,48.01 R53.CCW | v30.48,33.27 v36.32,33.27
  Bottom 0.178: 30.48,34.67 31.24,34.67 31.62,34.29 R9.1 | 30.48,34.67 28.7,34.67 C14.2 28.57,34.8 28.32,35.05 25.27,35.05 D3.3 | v64.14,51.82 64.14,49.66 IC9.1 64.01,49.53 62.61,49.53 56.64,43.56 49.28,43.56 48.39,42.67 | 30.48,34.67 v30.48,33.27 | v36.32,33.27 38.99,33.27 48.39,42.67 | v65.91,24.26 65.91,25.15 48.39,42.67
+5V  (via drill 0.71)
  Top 0.508: IC6.4 84.45,23.37 84.45,19.05 C22.1 84.71,18.92 v87.25,18.92 | 74.68,2.03 71.88,2.03 71.5,2.41 71.5,4.7 IC1.3 | 74.68,2.03 75.95,2.03 R2.2 | v74.68,2.16 74.68,2.03 | IC2.1 49.4,12.7 49.15,12.7 49.02,12.83 49.02,15.49 C9.1 49.15,15.62 50.55,15.62 | 54.61,14.1 54.61,16.38 C5.+VE 54.48,15.62 50.55,15.62 | 54.61,14.1 54.61,12.83 IC2.8 | IC5.4 17.02,41.15 17.03,41.16 17.03,43.31 17.65,43.94 17.91,43.94 C16.1 18.16,44.07 v19.56,44.07 | v49.53,33.91 49.53,35.69 IC7.4 | v6.48,12.06 6.86,12.45 6.99,12.45 v14.35,19.81 | v48.13,28.45 48.13,25.27 50.55,22.86 50.55,15.62 | v58.93,11.43 56.26,14.1 54.61,14.1
  Bottom 0.508: v87.25,18.92 89.92,16.26 89.92,12.57 79.5,2.16 v74.68,2.16 74.55,2.29 62.99,2.29 58.93,6.35 v58.93,11.43 | C37.1 4.95,12.06 v6.48,12.06 8.38,12.06 IC8.4 | 44.32,32.38 44.45,32.38 | 33.53,32.38 44.32,32.38 | 33.53,32.38 31.75,32.38 R9.2 | v19.56,44.07 21.21,44.07 26.29,38.99 | 26.29,38.99 28.96,36.32 32.38,36.32 33.53,35.18 33.53,32.38 | v14.35,19.81 14.35,27.05 26.29,38.99 | v48.13,28.45 44.32,32.26 44.32,32.38
  Bottom 0.61: 44.45,32.38 44.45,32.45 45.1,33.1 48.72,33.1 49.16,33.54 | 49.16,33.54 v49.53,33.91 | C34.1 47.55,35.15 49.16,33.54
+70V
  Bottom 0.508: IC9.5 70.87,49.66 71.25,50.04 74.3,50.04 C40.1 74.55,50.04 76.07,50.04 80.14,45.97 80.14,38.23 79.38,37.47 C12.+ 79.38,37.21 79.76,36.83 79.76,34.8 83.44,31.11 83.44,25.27 83.57,25.15 | 83.57,25.15 82.04,23.62 82.04,21.72 R5.2 | 83.57,25.15 84.96,25.15 D2.1
  Bottom 0.61: R5.2 81.95,20.35 82.9,19.4 82.9,17.1 81.5,15.7 IC3.2
-4.5V  (via drill 0.71)
  Top 0.508: IC6.11 84.58,28.7 84.58,31.5 C23.1 84.33,31.5 v81.53,31.5 | R8.1 63.88,10.54 63.5,10.16 62.36,10.16 IC4.5 62.23,10.29 v62.23,11.3 62.23,11.43 73.15,22.35 v73.15,23.11 | v60.07,6.73 60.07,5.46 59.05,4.45 C13.-VE | v49.53,28.7 49.53,30.48 IC7.11 | v28.19,22.35 28.19,24.13 27.94,24.38 | 27.94,24.38 20.7,31.62 20.7,31.88 19.05,31.88 C17.1 18.8,32 18.8,33.53 17.27,33.53 17.02,33.78 17.02,35.81 IC5.11 | v17.02,13.46 27.94,24.38
  Bottom 0.508: v62.23,11.3 62.23,8.89 v60.07,6.73 | v81.53,31.5 v73.15,23.11 73.03,23.24 59.69,23.24 53.21,29.72 50.55,29.72 v49.53,28.7 49.53,26.8 C35.1 49.28,26.54 49.28,25.02 49.15,24.89 33.91,24.89 31.37,22.35 29.84,22.35 R10.1 29.59,22.35 v28.19,22.35 | IC8.11 13.72,11.94 17.02,11.94 C38.1 17.02,12.19 v17.02,13.46
-5IN
  Top 0.508: IC4.2 59.82,9.14 59.94,9.02 61.34,9.02 61.34,6.6 61.85,6.1 61.85,2.79 61.21,2.16 55.37,2.16 55.24,2.29 55.24,3.56 54.36,4.45 54.1,4.45 C10.-VE 54.48,4.57 54.48,8.89 IC2.5
CUR_MOD2
  Top 0.178: SW10.COM 93.34,40.51 93.34,44.07 90.42,46.99 90.42,51.44 81.03,60.83 81.03,65.91 J2.CONDUCTOR
CUR_MOD_P3
  Top 0.178: IC6.7 88.39,23.5 90.93,23.5 R38.1 91.06,23.62 96.14,23.62 | 96.14,23.62 96.14,19.56 95.89,19.3 R35.CW 95.76,19.3 95.12,18.67 93.98,18.67 93.34,18.03 R35.W | 96.14,23.62 96.14,23.75 SW3.1 96.14,23.62
CUR_MOD_P4
  Top 0.178: 89.53,28.83 89.53,31.5 R43.2 | 89.53,28.83 89.41,28.7 88.39,28.7 IC6.8 | 89.53,28.83 91.06,27.3 96.14,27.3 SW3.2
GND  (via drill 0.51)
  Bottom 0.406: C40.2 74.3,39.7 67.5,39.7 | 67.5,39.7 60.5,39.7 60.5,39.8 67.5,39.8 67.5,39.7 | 67.5,39.7 IC9.3A
  other vias: 3.9,9.7 3.6,4.2 9.2,17.9 5.9,27 20.6,29.3 26.8,29 23.7,24.1 20.2,26 15.8,17.3 16.3,45.5 26.1,41.1 43.3,33.7 44.5,37.2 49.9,45.3 58.6,50.3 76.4,45.5 47.4,52.3 7.2,49.6 15.6,49.5 30.7,50 23.6,5 90.5,20 98.1,22.3 92.3,29.2 86.3,41.2 74.4,28.8 68.4,5.8 96,6.9 62.1,20.1 51.9,17.8 52.3,13.5 59.3,13.6 66.9,41.1 85.1,26.8 76,23.6 49.4,38 89.4,26.9 35,39.5 10.7,40.5 36.2,19.3 58.4,28 7.2,36.1 1.4,35.4 55.9,57.2 78,56.8 46,21.2 52.7,7.3
  pour Top: 0,0 100,0 100,51 92,51 92,75 0,75
  pour Bottom: 0,0 100,0 100,75 0,75
  pour Bottom: 34,18 34,6 25,6 25,18
INPUT_BUF  (via drill 0.51)  (6 unrouted)
  Top 0.178: C18.2 77.47,17.14 75.95,17.14 74.04,19.05 74.04,24.26 v73.53,24.77 | v49.53,42.67 32.64,42.67 32.26,43.05 29.97,43.05 29.97,44.07 24,44.07 R16.1 24,43.94 | 21.08,41.4 20.83,41.15 IC5.1
  Bottom 0.178: v73.53,24.77 67.31,24.77 49.53,42.55 v49.53,42.67
MOD_SP  (via drill 0.51)
  Top 0.178: v67.82,25.65 64.52,25.65 R11.W | v79.38,30.61 82.55,30.61 82.55,26.54 83.69,25.4 85.72,25.4 85.72,23.5 IC6.5
  Bottom 0.178: v67.82,25.65 74.42,25.65 v79.38,30.61
N$001  (via drill 0.51)
  Top 0.178: v13.46,25.4 14.73,25.4 14.73,24.38 R52.CCW
  Bottom 0.178: v13.46,25.4 13.46,26.92 13.84,27.3 13.84,33.53 13.34,34.04 13.34,54.74 17.65,59.05 17.65,62.36 19.43,64.14 29.08,64.14 29.46,64.52 31.88,64.52 32.13,64.26 50.42,64.26 52.07,65.91 57.02,65.91 R51.1
N$002  (via drill 0.51)
  Top 0.178: v18.92,17.4 15.37,20.95 14.35,20.95 13.59,21.72 R52.W
  Bottom 0.178: R54.1 19.05,8 19.05,9.53 20.45,10.92 20.45,14.86 20.32,14.99 19.05,14.99 R55.1 18.92,15.11 v18.92,17.4
N$003
  Bottom 0.178: R61.1 11.56,6.1 11.56,9.27 11.68,9.4 13.59,9.4 IC8.13 13.72,9.53 13.84,9.65 16.89,9.65 17.02,9.53 17.02,8 R54.2
N$004  (1 unrouted)
  Top 0.178: R16.2 23.88,45.97 20.57,45.97 19.05,47.5 15.37,47.5 14.99,47.12 R20.1 14.99,46.99 14.99,44.07 C21.1 14.99,43.94 14.48,43.43 14.48,41.15 IC5.6
N$005
  Bottom 0.178: IC8.14 13.59,8.13 13.46,8 13.46,6.1 R61.2 13.46,5.97 17.02,5.97 R63.1
N$006
  Top 0.178: C31.1 65.41,32.51 65.41,36.07 SW1.7
N$007  (via drill 0.51)
  Top 0.178: v18.29,19.81 18.29,21.21 SW6.2
  Bottom 0.178: v18.29,19.81 17.14,18.67 17.14,15.11 R55.2 17.02,14.99 15.75,14.99 15.62,14.86 15.62,12.7 15.49,12.57 12.19,12.57 12.19,10.73 12.95,10.73 13.59,10.79 IC8.12
N$008  (via drill 0.51)
  Top 0.178: v27.18,36.7 v27.18,42.42 | v39.24,59.05 41.4,59.05 46.74,64.39 46.74,65.66 46.99,65.91 J4.CONDUCTOR
  Bottom 0.178: v27.18,36.7 26.54,36.07 24.38,36.07 24.38,35.81 23.88,35.81 22.86,34.8 22.86,33.02 21.72,31.88 21.72,7.87 20.32,6.48 19.43,6.48 19.05,6.1 R63.2 | v27.18,42.42 35.43,50.67 35.43,55.24 v39.24,59.05
N$009
  Top 0.178: R26.CW 52.7,45.85 51.05,45.85 50.93,45.97 50.93,46.86 49.4,48.39 47.88,48.39 R25.CW 47.75,48.51 23.88,48.51 22.35,46.99 20.07,46.99 19.05,48.01 13.84,48.01 13.84,44.07 13.08,44.07 C21.2 | C21.2 13.08,43.94 13.08,41.15 IC5.7 | R24.CW 4.7,37.34 3.05,37.34 2.92,37.47 2.92,43.05 3.05,43.18 4.7,43.18 R22.CW 4.83,43.31 5.21,43.69 6.48,43.69 6.86,44.07 | 6.86,44.07 7.24,44.45 R22.W 6.86,44.07 | 6.86,44.07 12.95,44.07 C21.2
N$010
  Top 0.508: +5.1~+12V.TP 96.39,3.56 92.84,3.56 92.2,4.19 91.06,4.19 91.06,3.65 F1.1
N$011
  Top 0.178: R17.2 82.55,19.05 82.55,20.83 83.19,21.46 83.19,23.37 IC6.3
N$012
  Top 0.178: R27.2 10.92,36.96 10.54,37.34 9.4,37.34 8.89,37.85 8,37.85 7.37,38.48 R24.W
N$13
  Bottom 0.178: R1.2 44.45,17.91 44.07,17.53 43.18,17.53 43.18,17.4 42.42,16.64 40.51,16.64 40.51,15.49 U1.P$1
N$014
  Top 0.178: C25.1 11.05,32 11.05,34.92 R27.1 11.05,35.05 11.43,35.43 12.57,35.43 12.57,37.34 14.35,37.34 14.35,35.94 IC5.9 14.48,35.81 14.48,33.91 14.99,33.4 14.99,32 R34.2
N$015  (via drill 0.51)
  Top 0.178: R39.2 13.08,32 v13.08,33.15 13.08,35.81 IC5.8 | 7.37,31.75 7.37,32.38 R37.W 7.37,31.75 | 7.37,31.75 7.37,30.61 7.87,30.1 v9.65,30.1 10.92,30.1 C25.2 | 7.37,31.75 5.33,31.75 4.83,31.24 R37.CW
  Bottom 0.178: v13.08,33.15 12.7,33.15 v9.65,30.1
N$016
  Top 0.178: C29.1 70.48,32.51 70.48,36.07 SW1.9
N$17
  Bottom 0.178: C3.1 46.48,16 46.48,17.91 R1.1
N$018
  Top 0.178: C30.1 67.94,32.51 67.94,36.07 SW1.8
N$19
  Bottom 0.178: 44.58,13.59 44.58,13.97 R4.2 44.58,13.59 | 44.58,13.59 44.58,11.56 R3.1 | 44.58,13.59 40.64,13.59 40.51,13.72 U1.P$2
N$020
  Top 0.178: C32.1 62.87,32.51 62.87,36.07 SW1.6
N$021
  Top 0.178: C28.2 73.03,30.61 70.61,30.61 C29.2 70.48,30.61 68.07,30.61 C30.2 67.94,30.61 65.53,30.61 C31.2 65.41,30.61 62.99,30.61 C32.2 62.87,30.61 57.91,30.61 57.53,30.99 57.02,30.99 57.02,36.07 56.13,36.96 | 56.52,40.77 57.4,40.77 R40.2 | 56.52,40.77 55.63,40.77 C26.2 | 56.52,40.77 56.52,37.34 56.13,36.96 | 56.13,36.96 55.37,36.2 53.47,36.2 53.34,36.07 53.34,35.81 IC7.1
N$22
  Bottom 0.508: U1.P$4 40.39,10.29 37.97,10.29 37.85,10.16 37.85,7.75 38.35,7.24 38.35,5.97 39.24,5.08 39.5,5.08 D1.A- 39.75,4.83 39.75,2.67 45.47,2.67 51.69,8.89 55.88,8.89 L1.2
N$023
  Top 0.178: R29.2 53.59,40.77 53.59,43.69 55.24,45.34 55.24,47.12 R26.W
N$024  (via drill 0.51)
  Top 0.178: IC5.12 18.29,35.94 18.29,37.85 18.41,37.97 23.88,37.97 C20.2 24,37.85 25.53,37.85 25.65,37.72 25.65,36.83 27.43,35.05 v27.43,31.37
  Bottom 0.178: R13.2 33.02,28.32 30.73,28.32 R14.1 30.61,28.32 30.23,28.7 30.23,29.59 28.45,31.37 v27.43,31.37
N$025  (via drill 0.51)
  Top 0.178: v40.13,26.04 43.56,22.61 v49.53,22.61 | v52.45,22.61 70.74,22.61 71.88,23.75 71.88,25.53 R12.W
  Bottom 0.178: v40.13,26.04 33.53,26.04 33.15,26.42 R13.1 | v49.53,22.61 v52.45,22.61
N$026  (via drill 0.51)
  Top 0.178: IC7.2 52.07,35.81 52.58,36.32 52.58,38.48 52.83,38.73 53.47,38.73 R29.1 53.59,38.86 55.5,38.86 C26.1 55.63,38.73 v55.63,37.59 | SW1.1 73.03,44.83 70.61,44.83 SW1.2 70.48,44.83 68.07,44.83 SW1.3 67.94,44.83 65.53,44.83 SW1.4 65.41,44.83 62.99,44.83 SW1.5 62.87,44.7 61.34,44.7 60.33,43.69 v60.33,42.29
  Bottom 0.178: v55.63,37.59 v60.33,42.29
N$027
  Top 0.178: C28.1 73.03,32.51 73.03,36.07 SW1.10
N$028
  Top 0.178: SW10.1 95.63,38.73 95.63,36.7 93.34,34.42 93.34,32.51 R45.W
N$029  (via drill 0.51)
  Top 0.178: v43.69,27.94 43.69,26.92 43.94,26.67 R47.1 | v40.13,31.24 41.4,31.24 C33.2 41.53,31.24 43.94,31.24 R46.1 44.07,31.11 45.09,31.11 45.59,30.61 IC7.8 45.72,30.61 45.72,32.51 45.85,32.64 49.53,32.64 50.67,33.78 55.12,33.78 55.75,34.42 SW4.1
  Bottom 0.178: v43.69,27.94 43.43,27.94 v40.13,31.24
N$030
  Top 0.178: R33.2 41.53,35.56 43.31,35.56 45.09,33.78 48.01,33.78 48.13,33.91 48.13,35.69 IC7.5
N$031
  Top 0.178: R18.1 23.88,31.11 22.35,31.11 19.56,33.91 19.56,35.81 IC5.13
N$032
  Top 0.178: R28.1 16.89,32 16.51,32.38 16.51,33.27 15.88,33.91 15.88,35.69 15.75,35.81 IC5.10
N$033  (via drill 0.71)
  Top 0.508: v48.64,7.49 49.66,7.49 51.18,5.97 51.18,2.79 52.45,1.52 54.99,1.52 54.99,1.4 69.09,1.4 v69.09,3.3
  Bottom 0.508: 46.35,9.78 46.35,11.43 R3.2 | 46.35,9.78 43.81,7.24 43.81,5.46 43.43,5.08 D1.K+ | D2.3 86.11,22.86 86.11,18.29 86.61,17.78 86.61,15.24 85.85,14.48 C8.+ 85.6,14.35 84.45,13.21 80.9,13.21 IC3.3 80.64,12.95 80.64,11.56 72.39,3.3 v69.09,3.3 | 46.35,9.78 v48.64,7.49
N$034
  Bottom 0.178: R6.2 79.76,24.89 80.01,24.64 80.01,21.72 R5.1 80.14,21.59 80.14,20.19 80.26,20.07 80.26,18.8 80.77,18.29 IC3.1
N$035  (via drill 0.51)
  Top 0.178: v39.88,29.21 38.61,29.21 R44.1 | v45.59,27.05 47.24,28.7 47.24,28.91 48.23,29.91 48.23,29.97 48.13,30.48 IC7.10
  Bottom 0.178: v39.88,29.21 41.15,29.21 43.31,27.05 v45.59,27.05
N$036  (via drill 0.51)
  Top 0.178: v1.78,15.88 1.78,15.37 v6.35,10.79
  Bottom 0.178: 6.48,10.67 6.1,10.29 6.1,9.02 R50.1 | 6.48,10.67 8.38,10.67 IC8.3 | v1.78,15.88 2.92,15.88 R56.1 | 6.48,10.67 v6.35,10.79
N$037
  Top 0.178: R48.2 51.44,26.67 51.44,28.07 50.8,28.7 50.8,30.48 IC7.12
N$038
  Top 0.178: R49.2 55.5,26.67 53.59,26.67 C36.2 53.47,26.67 53.47,30.86 | 53.47,30.86 55.75,30.86 SW4.2 | 53.47,30.86 53.21,30.61 IC7.14 53.47,30.86
N$039
  Top 0.178: R20.2 12.95,46.99 6.99,46.99 6.35,46.35 5.46,46.35 4.83,45.72 R22.CCW
N$040  (via drill 0.51)
  Top 0.178: v43.05,38.86 44.45,38.86 C24.1 | v44.83,45.47 44.83,46.74 45.21,47.12 R25.W
  Bottom 0.178: v43.05,38.86 43.05,43.69 v44.83,45.47
N$041
  Top 0.178: IC2.2 49.4,11.56 42.93,11.56 42.55,11.94 C7.+VE
N$042
  Top 0.178: IC2.4 49.4,8.89 47.37,8.89 44.58,6.1 42.55,6.1 C7.-VE
N$043  (via drill 0.51)
  Top 0.178: v3.43,24.26 4.7,24.26 R64.CW
  Bottom 0.178: 6.35,15.88 8.38,15.88 IC8.7 | 6.35,15.88 4.95,15.88 R56.2 | 3.43,19.68 5.71,19.68 6.35,19.05 6.35,15.88 | 3.43,19.68 3.17,19.68 3.05,19.56 3.05,18.03 C39.2 | 3.43,19.68 v3.43,24.26
N$044
  Bottom 0.178: IC8.1 8.38,8.13 8.38,7.11 6.1,7.11 R50.2 5.97,7.11 4.45,7.11 1.4,10.16 1.4,13.46 1.65,13.72 2.67,13.72 2.92,13.97 R58.1
N$045
  Bottom 0.178: 5.21,14.35 5.33,14.48 8.38,14.48 IC8.6 | 5.21,14.35 4.95,14.1 R58.2 5.21,14.35 | 5.21,14.35 4.06,14.35 4.06,17.02 4.7,17.02 4.83,17.14 4.83,17.91 C39.1
N$046
  Bottom 0.178: R59.2 71.88,55.37 69.47,55.37 R62.1 69.34,55.24 67.82,55.24 67.56,54.99 67.56,53.72 67.44,53.59 66.04,53.59 65.91,53.47 R60.1 65.91,53.34 65.91,49.66 IC9.2
N$047  (via drill 0.51)
  Top 0.178: v65.02,56.77 65.02,55.88 v67.94,52.96
  Bottom 0.178: R66.1 63.12,61.09 64.9,61.09 R65.1 65.02,60.96 v65.02,56.77 | 69.34,52.96 69.34,49.78 69.22,49.66 IC9.4 | 69.34,52.96 69.34,53.34 R62.2 69.34,52.96 | 69.34,52.96 v67.94,52.96
N$048
  Bottom 0.178: R59.1 72.01,53.34 75.06,53.34 80.39,48.01 82.8,48.01 R53.W
N$049  (via drill 0.51)
  Top 0.178: v56.77,53.47 55.37,53.47 R57.W
  Bottom 0.178: v56.77,53.47 58.55,55.24 65.79,55.24 R60.2
N$050
  Top 0.178: R36.1 38.61,40.77 41.4,40.77 C27.1 41.53,40.77 41.78,41.02 41.78,42.04 42.04,42.29 47.88,42.29 48.64,41.53 48.64,38.99 48.51,38.86 47.12,38.86 R30.2 46.99,38.73 46.99,35.81 IC7.6
N$051
  Top 0.178: R41.2 38.48,35.69 38.48,38.73 R36.2 38.61,38.86 41.4,38.86 C27.2 41.53,38.73 41.53,37.34 42.29,37.34 43.81,35.81 45.59,35.81 IC7.7
N$052
  Top 0.178: C24.2 44.58,40.77 46.99,40.77 R30.1
N$053  (via drill 0.51)
  Top 0.178: v48.64,23.5 47.5,24.64 44.07,24.64 R47.2 | v53.47,23.5 53.47,24.64 C36.1 53.59,24.77 55.5,24.77 R49.1 55.63,24.77 v56.9,24.77 | v52.07,28.83 52.07,30.48 IC7.13
  Bottom 0.178: v48.64,23.5 v53.47,23.5 | v52.07,28.83 52.83,28.83 v56.9,24.77
N$054
  Top 0.178: R42.2 87,31.5 86.74,31.5 86.36,31.11 86.36,29.21 85.85,28.7 IC6.10
N$055
  Top 0.178: R64.W 5.97,21.84 4.06,21.84 2.54,23.37 2.54,46.99 6.22,50.67 6.22,52.96 SW7.NC
N$056
  Top 0.178: R32.1 51.44,38.73 51.05,38.35 51.05,36.07 50.8,35.81 IC7.3
N$057
  Top 0.178: IC4.3 59.69,8.26 57.28,8.26 57.02,8.51 C11.2
N$058
  Bottom 0.178: IC8.9 13.59,14.61 11.68,14.61 10.41,15.88 10.41,28.19 8.89,29.72 8.89,48.64 10.92,50.67 10.92,52.96 SW7.C
N$059
  Top 0.178: J3.CONDUCTOR 9.02,65.91 9.02,60.96 14.73,55.24 14.73,53.98 15.62,53.09 SW7.NO
N$060
  Top 0.178: IC4.4 62.36,8.26 63.63,8.26 63.88,8.51 R8.2 64.01,8.64 66.93,8.64 R7.1
N$061
  Top 0.178: IC7.9 46.86,30.48 46.86,29.73 46.35,29.22 46.35,29.21 44.07,29.21 R46.2 43.94,29.34 41.53,29.34 C33.1 41.4,29.34 41.02,28.96 41.02,27.94 40.89,27.81 34.42,27.81 32.26,29.97 28.96,29.97 SW2.COM 28.83,30.1 28.83,36.45 SW9.COM 28.83,36.58 28.83,42.93 SW8.COM
N$062
  Top 0.178: IC6.14 80.77,28.57 81.92,28.57 IC6.13
N$065  (1 unrouted)
N$085
  Top 0.178: R34.1 14.99,30.1 14.22,30.1 13.97,30.35 13.97,30.86 9.53,30.86 9.02,31.37 9.02,33.91 8.51,34.42 4.83,34.42 4.83,33.78 R37.CCW
N$093  (via drill 0.51)
  Top 0.178: R12.CCW 69.34,26.92 61.98,26.92 R11.CCW 61.85,26.8 60.07,26.8 v56.9,23.62
  Bottom 0.178: D4.1 26.16,26.42 28.57,26.42 C15.1 28.7,26.42 29.21,25.91 29.21,24.64 29.46,24.38 | 29.46,24.38 29.59,24.26 R10.2 29.46,24.38 | 29.46,24.38 29.08,24 28.19,24 27.3,23.11 27.3,21.97 28.32,20.95 31.97,20.95 35.27,24.26 56.26,24.26 v56.9,23.62
N$097
  Top 0.178: C18.1 77.47,19.05 77.47,21.97 R15.1
N$098
  Top 0.178: 77.47,25.65 77.47,26.04 R19.1 77.47,25.65 | 77.47,25.65 77.47,24 R15.2 | 77.47,25.65 81.66,25.65 81.92,25.4 81.92,23.5 IC6.2
N$099
  Top 0.178: 78.61,33.27 78.23,33.27 R21.CW 78.61,33.27 | 78.61,33.27 78.99,33.66 80.01,33.66 80.77,34.42 R21.W | 80.52,21.34 80.52,23.24 80.64,23.37 IC6.1 | 80.52,21.34 80.52,19.05 R23.1 | 78.61,33.27 78.61,29.34 79.5,28.45 79.5,27.18 80.26,26.42 81.53,26.42 82.55,25.4 82.55,21.46 82.42,21.34 80.52,21.34
N$100
  Top 0.178: R23.2 80.52,17.02 80.9,16.64 80.9,15.75 81.15,15.49 85.47,15.49 86.23,16.26 86.23,16.89 87.5,16.89 R31.1 87.63,17.02 88.14,17.02 88.14,19.3 87.12,20.32 87.12,23.37 IC6.6
N$101
  Top 0.178: R38.2 90.93,25.53 88.27,25.53 87.12,26.67 87.12,28.57 IC6.9 87.12,28.7 87.12,29.97 88.01,29.97 88.01,33.02 89.03,33.02 89.41,33.4 R43.1
N$102  (via drill 0.51)
  Top 0.178: v56.26,44.32 59.05,41.53 59.05,38.86 57.53,38.86 R40.1 | v44.83,44.32 31.62,44.32 31.24,44.7 SW8.2
  Bottom 0.178: v44.83,44.32 v56.26,44.32
N$103
  Top 0.178: R41.1 38.48,33.78 36.96,33.78 32.77,37.97 31.5,37.97 31.24,38.23 SW9.2
N$104  (via drill 0.51)
  Top 0.178: v22.61,28.32 22.35,28.07 14.1,28.07 13.46,28.7 13.46,29.59 13.08,29.97 R39.1 | v29.59,31.62 30.99,31.62 31.11,31.75 SW2.2
  Bottom 0.178: v22.61,28.32 22.61,28.57 25.27,31.24 25.27,33.91 29.72,33.91 29.72,31.62 v29.59,31.62
N$105
  Top 0.178: R19.2 77.47,28.07 77.47,31.24 76.45,32.26 76.45,35.56 76.58,35.69 78.11,35.69 R21.CCW
N$106
  Top 0.178: R31.2 89.53,16.89 91.19,16.89 91.95,16.13 95.12,16.13 95.76,16.76 R35.CCW
N$107
  Top 0.178: SW3.COM 93.85,25.53 97.28,25.53 97.92,26.16 97.92,33.15 97.41,33.66 95.89,33.66 R45.CW
PID_OUT
  Top 0.178: SW4.COM 58.17,32.77 58.17,36.96 59.44,38.23 59.44,46.1 55.5,50.04 43.43,50.04 42.42,49.02 38.86,49.02 37.21,50.67 37.21,52.96 SW5.NC
PIEZO_CTRL1
  Top 0.178: R57.CCW 52.7,54.74 44.7,54.74 42.55,56.9 34.16,56.9 32.51,55.24 32.51,53.09 SW5.C
SCAN_O  (via drill 0.51)
  Top 0.178: v18.41,28.83 18.41,28.57 14.99,28.57 14.86,28.7 v14.86,28.83
  Bottom 0.178: IC8.10 13.72,13.34 14.35,13.97 14.99,13.97 14.99,15.11 14.35,15.11 13.72,15.75 IC8.8 13.72,15.88 13.72,17.91 18.41,22.61 v18.41,28.83 | v14.86,28.83 14.86,40.64 19.18,44.96 21.08,44.96 21.59,44.45 22.48,44.45 27.69,49.66 27.69,52.96 SW5.NO
SETPOINT  (via drill 0.51)
  Top 0.178: R18.2 23.88,33.02 v21.72,33.02 20.83,33.91 20.83,35.81 IC5.14 20.83,35.94 v21.84,35.94 | v15.75,39.24 15.75,41.02 IC5.5 | v6.6,13.34 7.87,14.61 7.87,23.5 7.37,24 7.37,24.26 R64.CCW 7.37,24.38 8.76,24.38 11.05,26.67 v15.24,26.67
  Bottom 0.178: v15.75,39.24 18.54,39.24 v21.84,35.94 | v6.6,13.34 8.38,13.34 IC8.5 8.51,13.21 10.41,13.21 10.41,9.53 8.51,9.53 IC8.2 | v21.72,33.02 21.46,33.02 15.24,26.8 v15.24,26.67
VIN  (via drill 0.71)
  Top 0.508: C2.2 81.03,3.94 84.33,3.94 84.58,4.19 84.58,4.17 84.65,4.1 | 84.71,4.45 F1.2 84.65,4.1 | v40.39,7.37 40.26,7.37 40.13,7.49 40.13,15.62 v42.29,17.78 | v68.45,8.51 70.61,8.51 71.25,9.14 IC1.1 71.5,9.4 72.39,10.29 72.39,11.56 72.52,11.68 82.22,11.68 82.9,11 84.45,11 C1.+ 84.65,4.1
  Bottom 0.508: C6.2 40.89,18.03 | v40.39,7.37 40.39,8.51 U1.P$5 | C6.2 41.02,17.78 v42.29,17.78 42.55,18.03 42.55,18.67 43.43,19.56 48.13,19.56 48.64,20.07 55.88,20.07 L1.1 55.88,19.81 58.93,19.81 63.25,15.49 63.25,8.89 63.88,8.26 68.33,8.26 68.45,8.38 v68.45,8.51 | C4.+ 39.35,21.55 41,19.9 41,18.05 C6.2
VPIEZO
  Bottom 0.178: R51.2 59.05,65.91 59.05,64.39 59.31,64.14 60.33,64.14 61.47,62.99 62.99,62.99 R66.2 | 63.5,62.99 63.12,62.99 R66.2 | 63.5,62.99 64.9,62.99 R65.2 | 63.5,62.99 63.5,65.53 63.88,65.91 J5.CONDUCTOR | R66.2 63.5,62.99

### Text on the board
Top: Pandora Driver | Rev: A
Graphics: Mov SW10